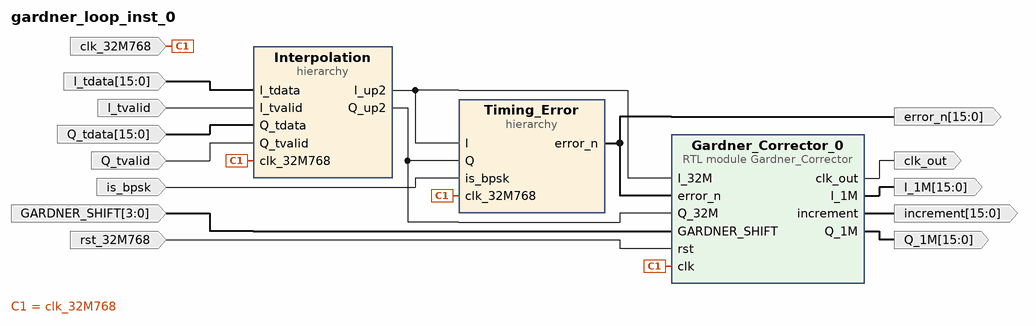
[diagram p0: block diagram of the top level]
# Vivado block design gardner_loop_inst_0, xc7z020clg484-1, Vivado 2022.2
create_bd_design gardner_loop_inst_0

create_bd_port -dir I -type clk clk_32M768
create_bd_port -dir I -type data is_bpsk
create_bd_port -dir O -from 15 -to 0 I_1M
create_bd_port -dir O -from 15 -to 0 Q_1M
create_bd_port -dir O clk_out
create_bd_port -dir I -type rst rst_32M768
create_bd_port -dir I -from 3 -to 0 -type data GARDNER_SHIFT
create_bd_port -dir O -from 15 -to 0 -type data error_n
create_bd_port -dir I -from 15 -to 0 I_tdata
create_bd_port -dir I I_tvalid
create_bd_port -dir I -from 15 -to 0 Q_tdata
create_bd_port -dir I Q_tvalid
create_bd_port -dir O -from 15 -to 0 increment

create_bd_cell -type hier Interpolation
create_bd_cell -type hier Timing_Error
create_bd_cell -type module -reference Gardner_Corrector Gardner_Corrector_0

# ---- hierarchy /Interpolation ----
current_bd_instance /Interpolation
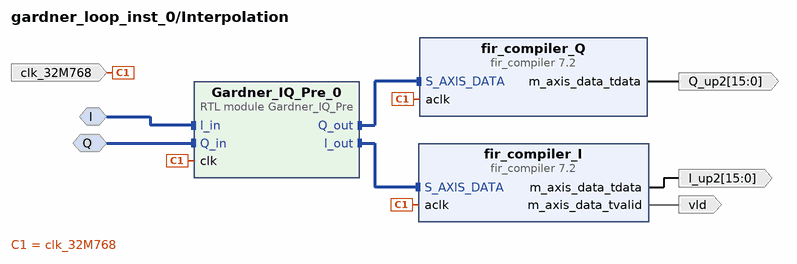
[diagram p1: block diagram inside /Interpolation]
create_bd_intf_pin -mode Slave -vlnv xilinx.com:interface:axis_rtl:1.0 I
create_bd_intf_pin -mode Slave -vlnv xilinx.com:interface:axis_rtl:1.0 Q
create_bd_pin -dir I -type clk clk_32M768
create_bd_pin -dir O -from 15 -to 0 I_up2
create_bd_pin -dir O -from 15 -to 0 Q_up2
create_bd_pin -dir O vld

create_bd_cell -type ip -vlnv xilinx.com:ip:fir_compiler:7.2 fir_compiler_I
set_property -dict [list \
  CONFIG.Clock_Frequency 32.768 \
  CONFIG.CoefficientVector 1,2,1,0 \
  CONFIG.Coefficient_Fractional_Bits 14 \
  CONFIG.Coefficient_Sets 1 \
  CONFIG.Coefficient_Sign Unsigned \
  CONFIG.Coefficient_Structure Inferred \
  CONFIG.Coefficient_Width 16 \
  CONFIG.ColumnConfig 2 \
  CONFIG.DATA_Has_TLAST Not_Required \
  CONFIG.Decimation_Rate 1 \
  CONFIG.Filter_Architecture Systolic_Multiply_Accumulate \
  CONFIG.Filter_Type Interpolation \
  CONFIG.Interpolation_Rate 2 \
  CONFIG.M_DATA_Has_TUSER Not_Required \
  CONFIG.Number_Channels 1 \
  CONFIG.Number_Paths 1 \
  CONFIG.Output_Rounding_Mode Truncate_LSBs \
  CONFIG.Output_Width 16 \
  CONFIG.Quantization Quantize_Only \
  CONFIG.RateSpecification Frequency_Specification \
  CONFIG.S_DATA_Has_TUSER Not_Required \
  CONFIG.Sample_Frequency 16.384 \
  CONFIG.Select_Pattern All \
  CONFIG.Zero_Pack_Factor 1 \
] [get_bd_cells fir_compiler_I]
create_bd_cell -type ip -vlnv xilinx.com:ip:fir_compiler:7.2 fir_compiler_Q
set_property -dict [list \
  CONFIG.Clock_Frequency 32.768 \
  CONFIG.CoefficientVector 1,2,1,0 \
  CONFIG.Coefficient_Fractional_Bits 14 \
  CONFIG.Coefficient_Sets 1 \
  CONFIG.Coefficient_Sign Unsigned \
  CONFIG.Coefficient_Structure Inferred \
  CONFIG.Coefficient_Width 16 \
  CONFIG.ColumnConfig 2 \
  CONFIG.DATA_Has_TLAST Not_Required \
  CONFIG.Decimation_Rate 1 \
  CONFIG.Filter_Architecture Systolic_Multiply_Accumulate \
  CONFIG.Filter_Type Interpolation \
  CONFIG.Interpolation_Rate 2 \
  CONFIG.M_DATA_Has_TUSER Not_Required \
  CONFIG.Number_Channels 1 \
  CONFIG.Number_Paths 1 \
  CONFIG.Output_Rounding_Mode Truncate_LSBs \
  CONFIG.Output_Width 16 \
  CONFIG.Quantization Quantize_Only \
  CONFIG.RateSpecification Frequency_Specification \
  CONFIG.S_DATA_Has_TUSER Not_Required \
  CONFIG.Sample_Frequency 16.384 \
  CONFIG.Select_Pattern All \
  CONFIG.Zero_Pack_Factor 1 \
] [get_bd_cells fir_compiler_Q]
create_bd_cell -type module -reference Gardner_IQ_Pre Gardner_IQ_Pre_0
set_property -dict {CONFIG.SHIFT 0} [get_bd_cells Gardner_IQ_Pre_0]

# ---- hierarchy /Timing_Error ----
current_bd_instance /Timing_Error
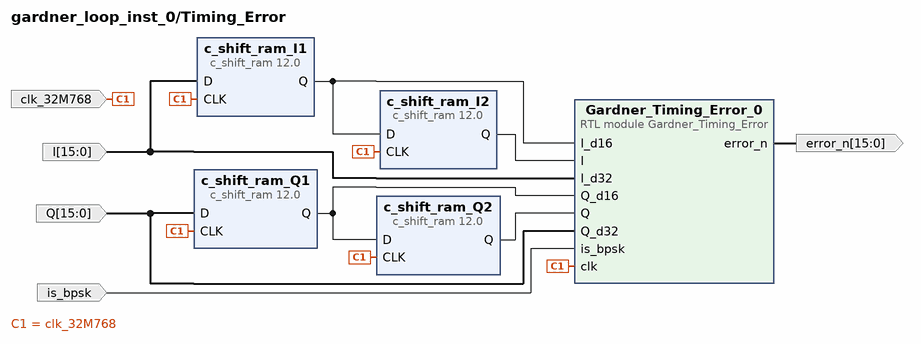
[diagram p2: block diagram inside /Timing_Error]
create_bd_pin -dir I -from 15 -to 0 I
create_bd_pin -dir I -type clk clk_32M768
create_bd_pin -dir I -type data is_bpsk
create_bd_pin -dir I -from 15 -to 0 -type data Q
create_bd_pin -dir O -from 15 -to 0 error_n

create_bd_cell -type ip -vlnv xilinx.com:ip:c_shift_ram:12.0 c_shift_ram_I1
create_bd_cell -type ip -vlnv xilinx.com:ip:c_shift_ram:12.0 c_shift_ram_I2
create_bd_cell -type ip -vlnv xilinx.com:ip:c_shift_ram:12.0 c_shift_ram_Q1
create_bd_cell -type ip -vlnv xilinx.com:ip:c_shift_ram:12.0 c_shift_ram_Q2
create_bd_cell -type module -reference Gardner_Timing_Error Gardner_Timing_Error_0

# ---- connections ----

current_bd_instance /Interpolation
connect_bd_intf_net [get_bd_intf_pins Gardner_IQ_Pre_0/I_out] [get_bd_intf_pins fir_compiler_I/S_AXIS_DATA]
connect_bd_intf_net [get_bd_intf_pins Gardner_IQ_Pre_0/Q_out] [get_bd_intf_pins fir_compiler_Q/S_AXIS_DATA]
connect_bd_intf_net [get_bd_intf_pins I] [get_bd_intf_pins Gardner_IQ_Pre_0/I_in]
connect_bd_intf_net [get_bd_intf_pins Q] [get_bd_intf_pins Gardner_IQ_Pre_0/Q_in]
connect_bd_net -net clk_32d768_1 [get_bd_pins clk_32M768] \
  [get_bd_pins fir_compiler_I/aclk] [get_bd_pins fir_compiler_Q/aclk] [get_bd_pins Gardner_IQ_Pre_0/clk]
connect_bd_net [get_bd_pins fir_compiler_I/m_axis_data_tdata] [get_bd_pins I_up2]
connect_bd_net [get_bd_pins fir_compiler_I/m_axis_data_tvalid] [get_bd_pins vld]
connect_bd_net [get_bd_pins fir_compiler_Q/m_axis_data_tdata] [get_bd_pins Q_up2]

current_bd_instance /Timing_Error
connect_bd_net [get_bd_pins Gardner_Timing_Error_0/error_n] [get_bd_pins error_n]
connect_bd_net -net Interpolation_Ix2_tdata [get_bd_pins I] [get_bd_pins c_shift_ram_I1/D] [get_bd_pins Gardner_Timing_Error_0/I_d32]
connect_bd_net -net Interpolation_Qx2_tdata [get_bd_pins Q] [get_bd_pins c_shift_ram_Q1/D] [get_bd_pins Gardner_Timing_Error_0/Q_d32]
connect_bd_net [get_bd_pins c_shift_ram_I1/Q] [get_bd_pins c_shift_ram_I2/D] [get_bd_pins Gardner_Timing_Error_0/I_d16]
connect_bd_net [get_bd_pins c_shift_ram_I2/Q] [get_bd_pins Gardner_Timing_Error_0/I]
connect_bd_net [get_bd_pins c_shift_ram_Q1/Q] [get_bd_pins c_shift_ram_Q2/D] [get_bd_pins Gardner_Timing_Error_0/Q_d16]
connect_bd_net [get_bd_pins c_shift_ram_Q2/Q] [get_bd_pins Gardner_Timing_Error_0/Q]
connect_bd_net -net clk_32d768_1 [get_bd_pins clk_32M768] \
  [get_bd_pins c_shift_ram_Q1/CLK] [get_bd_pins c_shift_ram_I2/CLK] [get_bd_pins c_shift_ram_Q2/CLK] \
  [get_bd_pins c_shift_ram_I1/CLK] [get_bd_pins Gardner_Timing_Error_0/clk]
connect_bd_net [get_bd_pins is_bpsk] [get_bd_pins Gardner_Timing_Error_0/is_bpsk]

current_bd_instance /
connect_bd_net [get_bd_ports GARDNER_SHIFT] [get_bd_pins Gardner_Corrector_0/GARDNER_SHIFT]
connect_bd_net [get_bd_pins Gardner_Corrector_0/I_1M] [get_bd_ports I_1M]
connect_bd_net [get_bd_pins Gardner_Corrector_0/Q_1M] [get_bd_ports Q_1M]
connect_bd_net [get_bd_pins Gardner_Corrector_0/clk_out] [get_bd_ports clk_out]
connect_bd_net [get_bd_pins Gardner_Corrector_0/increment] [get_bd_ports increment]
connect_bd_net [get_bd_ports I_tdata] [get_bd_pins Interpolation/I_tdata]
connect_bd_net [get_bd_ports I_tvalid] [get_bd_pins Interpolation/I_tvalid]
connect_bd_net -net Interpolation_Ix2_tdata [get_bd_pins Interpolation/I_up2] [get_bd_pins Timing_Error/I] [get_bd_pins Gardner_Corrector_0/I_32M]
connect_bd_net -net Interpolation_Qx2_tdata [get_bd_pins Interpolation/Q_up2] [get_bd_pins Timing_Error/Q] [get_bd_pins Gardner_Corrector_0/Q_32M]
connect_bd_net [get_bd_ports Q_tdata] [get_bd_pins Interpolation/Q_tdata]
connect_bd_net [get_bd_ports Q_tvalid] [get_bd_pins Interpolation/Q_tvalid]
connect_bd_net [get_bd_pins Timing_Error/error_n] [get_bd_ports error_n] [get_bd_pins Gardner_Corrector_0/error_n]
connect_bd_net -net clk_32d768_1 [get_bd_ports clk_32M768] \
  [get_bd_pins Interpolation/clk_32M768] [get_bd_pins Timing_Error/clk_32M768] [get_bd_pins Gardner_Corrector_0/clk]
connect_bd_net [get_bd_ports is_bpsk] [get_bd_pins Timing_Error/is_bpsk]
connect_bd_net -net rst_32M768_1 [get_bd_ports rst_32M768] [get_bd_pins Gardner_Corrector_0/rst]

validate_bd_design
save_bd_design
